# Altium schematic sheet XL4015.SchDoc
size A3
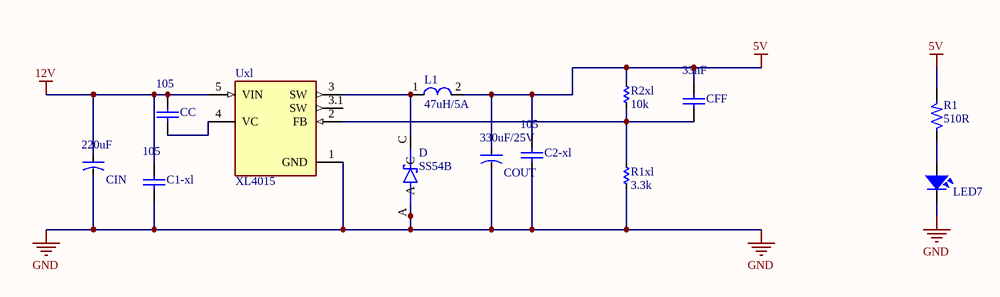
[diagram p0: XL4015.SchDoc]

## Parts
C1-xl  105  [C0805]
C2-xl  105  [C0805]
CC  105  [C0805]
CFF  33nF  [C0805]
CIN  220uF  [CAP-ALU-SMD-6.3x7.7x2.2]
COUT  330uF/25V  [CAP-ALU-SMD-F]
D  SS54B  [DIOM4336X244N]
L1  47uH/5A  [L-DIP-M-18.5x8]
LED7  LED SMD  [SM-LED-0805-Blue]  (value not drawn)
R1  510R  [SM-RES-0805]
R1xl  3.3k  [RES-SMD-0805]
R2xl  10k  [RES-SMD-0805]
Uxl  XL4015  [CONV_XL4015]

## Nets
5V: C2-xl.2 CFF.2 COUT.1 L1.2 R1.2 R2xl.1
12V: C1-xl.2 CC.2 CIN.1 Uxl.5(VIN)
GND: C1-xl.1 C2-xl.1 CIN.2 COUT.2 D.A LED7.2 R1xl.2 Uxl.1(GND)
NetCC_1: CC.1 Uxl.4(VC)
NetCFF_1: CFF.1 R1xl.1 R2xl.2 Uxl.2(FB)
NetD_C: D.C L1.1 Uxl.3(SW)
NetLED7_1: LED7.1 R1.1

Not connected (* = marked no-connect by the designer): Uxl 3.1(SW)

## Library data of the parts
C1-xl C2-xl CC CFF = CapSMD: Capacitor; Value: 33p; Published: 8-Jun-2000; LatestRevisionDate: 17-Jul-2002; LatestRevisionNote: Re-released for DXP Platform.; PackageReference: RAD-0.3; Publisher: Altium Limited
CIN COUT = CN-ALU-SMD: Polarized Capacitor (Axial); Published: 8-Jun-2000; LatestRevisionDate: 17-Jul-2002; LatestRevisionNote: Re-released for DXP Platform.; PackageReference: POLAR0.8; Publisher: Altium Limited
D = SS54B: Diode Schottky 40V 5A Surface Mount SMBF; MF: JCET; SnapEDA_Link: https://www.snapeda.com/parts/SS54B/JCET/view-part/105689/?ref=snap; Price: None; Availability: Unavailable; Package: None; MP: SS54B; Value: *
L1 = L-SMD-1: partNo: 78477010; Manufacturer: Wurth Elektronik; Inductance: 1.0 μH; ComponentLink1Description: Manufacturer; ComponentLink1URL: http://www.we-online.de; Created by: Baojun Chen; Created Date: Nov.2015; ComponentLink2Description: Datasheet; ComponentLink2URL: http://katalog.we-online.de/pbs/datasheet/78477010.pdf
LED7 = LED-SMD-0805
R1 = R: Resistor 1/4W; Value: R1/4W - 1K
R1xl R2xl = Res-SMD: Resistor; Manufacturer: Generic Components; Class: Passive; Published: 08/06/2000; Publisher: Altium Hobart Technology Centre
Uxl = XL4015: 5A 180KHz 36V Buck DC to DC Converter; MF: XLSEMI; Value: *; Availability: Unavailable; Price: None; SnapEDA_Link: https://www.snapeda.com/parts/XL4015/XLSEMI/view-part/4725363/?ref=snap; Package: Package; MP: XL4015